# Altium schematic sheet CyberAss.SchDoc: MCU
size A4; DrawnBy: Ma Haocheng; Revision: 0.3; SheetNumber: 1; SheetTotal: 2
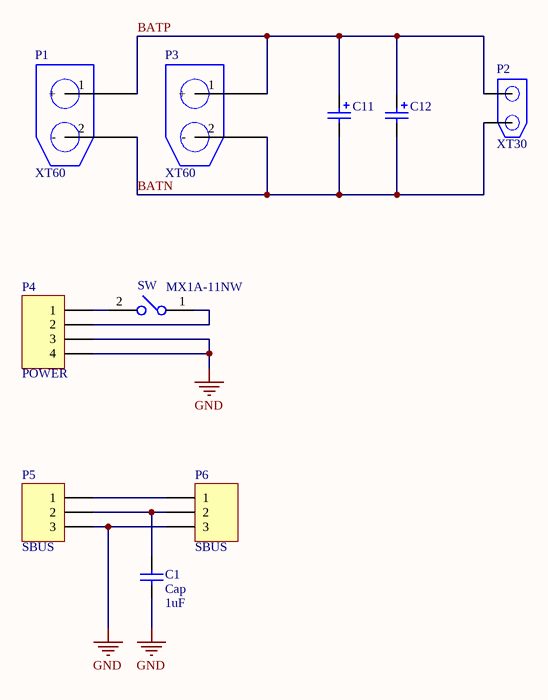
[diagram p0: CyberAss.SchDoc]

## Parts
C1  Cap  value 1uF  [6-0805_M]
C11  35V 47uf  [C3528]  (value not drawn)
C12  35V 47uf  [C3528]  (value not drawn)
P1  XT60  [XT60]
P2  XT30  [XT30]
P3  XT60  [XT60]
P4  POWER  [SS1.0-2p]
P5  SBUS  [XH2.54-3p]
P6  SBUS  [HDR1X3]
SW  Part Number: MX1A-11NW  [Cherry_MX1A-11NW_0]  (hidden comment: Switch_Cherry_MX1A-11NW_eec)

## Nets
GND: C1.1 P4.3 P4.4 P5.3 P6.3
BATN: C11.2 C12.2 P1.2(-) P2.2(-) P3.2(-)
BATP: C11.1 C12.1 P1.1(+) P2.1(+) P3.1(+)
NetC1_2: C1.2 P5.2 P6.2
NetP4_1: P4.1 SW.2
NetP4_2: P4.2 SW.1
NetP5_1: P5.1 P6.1

## Library data of the parts
C1 = Cap: Capacitor; Published: 8-Jun-2000; LatestRevisionDate: 17-Jul-2002; LatestRevisionNote: Re-released for DXP Platform.; PackageReference: RAD-0.3; Publisher: Altium Limited; PackageDescription: Radial Cap, Thru-Hole; 2 Leads; 0.3 in Pin Spacing
C11 C12 = Cap Pol2: Polarized Capacitor (Axial); Published: 8-Jun-2000; LatestRevisionDate: 17-Jul-2002; LatestRevisionNote: Re-released for DXP Platform.; PackageReference: POLAR0.8; Publisher: Altium Limited; PackageDescription: Polarized Capacitor; 2 Leads
P4 = Header 4: Header, 4-Pin; LatestRevisionDate: 17-Jul-2002; LatestRevisionNote: Re-released for DXP Platform.; Publisher: Altium Limited
P5 P6 = Header 3: Header, 3-Pin; LatestRevisionDate: 17-Jul-2002; LatestRevisionNote: Re-released for DXP Platform.; Publisher: Altium Limited
SW = Switch_Cherry_MX1A-11NW_eec: SWITCH Pushbutton Switch SPST-NO Keyswitch Through Hole; Manufacturer: Cherry; Category 8Ce341E9Bf4C5724: Switches; size_length: 15.6 mm; contact_current_rating: 10 mA; Category Db391633E8F300Fe: Industrial Control; Category 6A0Ba70159B8B1Cc: Keylock; contact_plating: Gold; Category A9A064Aa9A0A7267: Tactile / Jog; contacts_type: SPST; Num Pins: 2; Category 6E88A3825D3Cb54F: Uncategorized; helpURL: https://upverter.com/upn/revision/2ca27a2fbe391082/; ComponentLink2Description: Datasheet; Temperature: -10 to +70; Package: SW_15MM6_15_6; Supplier 2: Mouser; Price: 0.648391469733; Supplier 1: Digi-Key; ComponentLink1URL: https://upverter.com/upn/revision/2ca27a2fbe391082/; Supplier Part Number 2: 540-MX1A-11NW; Supplier Part Number 1: CH160-ND; ComponentLink1Description: Upverter; ComponentLink2URL: https://upverter.com/datasheet/a174b925b05052267a652262a41f429ea7a87855.pdf; RoHS: TRUE; Mouser Part Number: 540-MX1A-11NW; orientation: Vertical; Temperature Range High: +70; Octopart Part Number: MX1A-11NW; Digikey Description: SWITCH Pushbutton Switch SPST-NO Keyswitch Through Hole; Digikey Part Number: CH160-ND; Lead Free: yes; Temperature Range Low: -10; Category 2Bfae6F01857F03D: Pushbutton; Mounting Type: lug; size_width: 15.6 mm